# Altium schematic sheet cam_cross_link.SchDoc
size A3
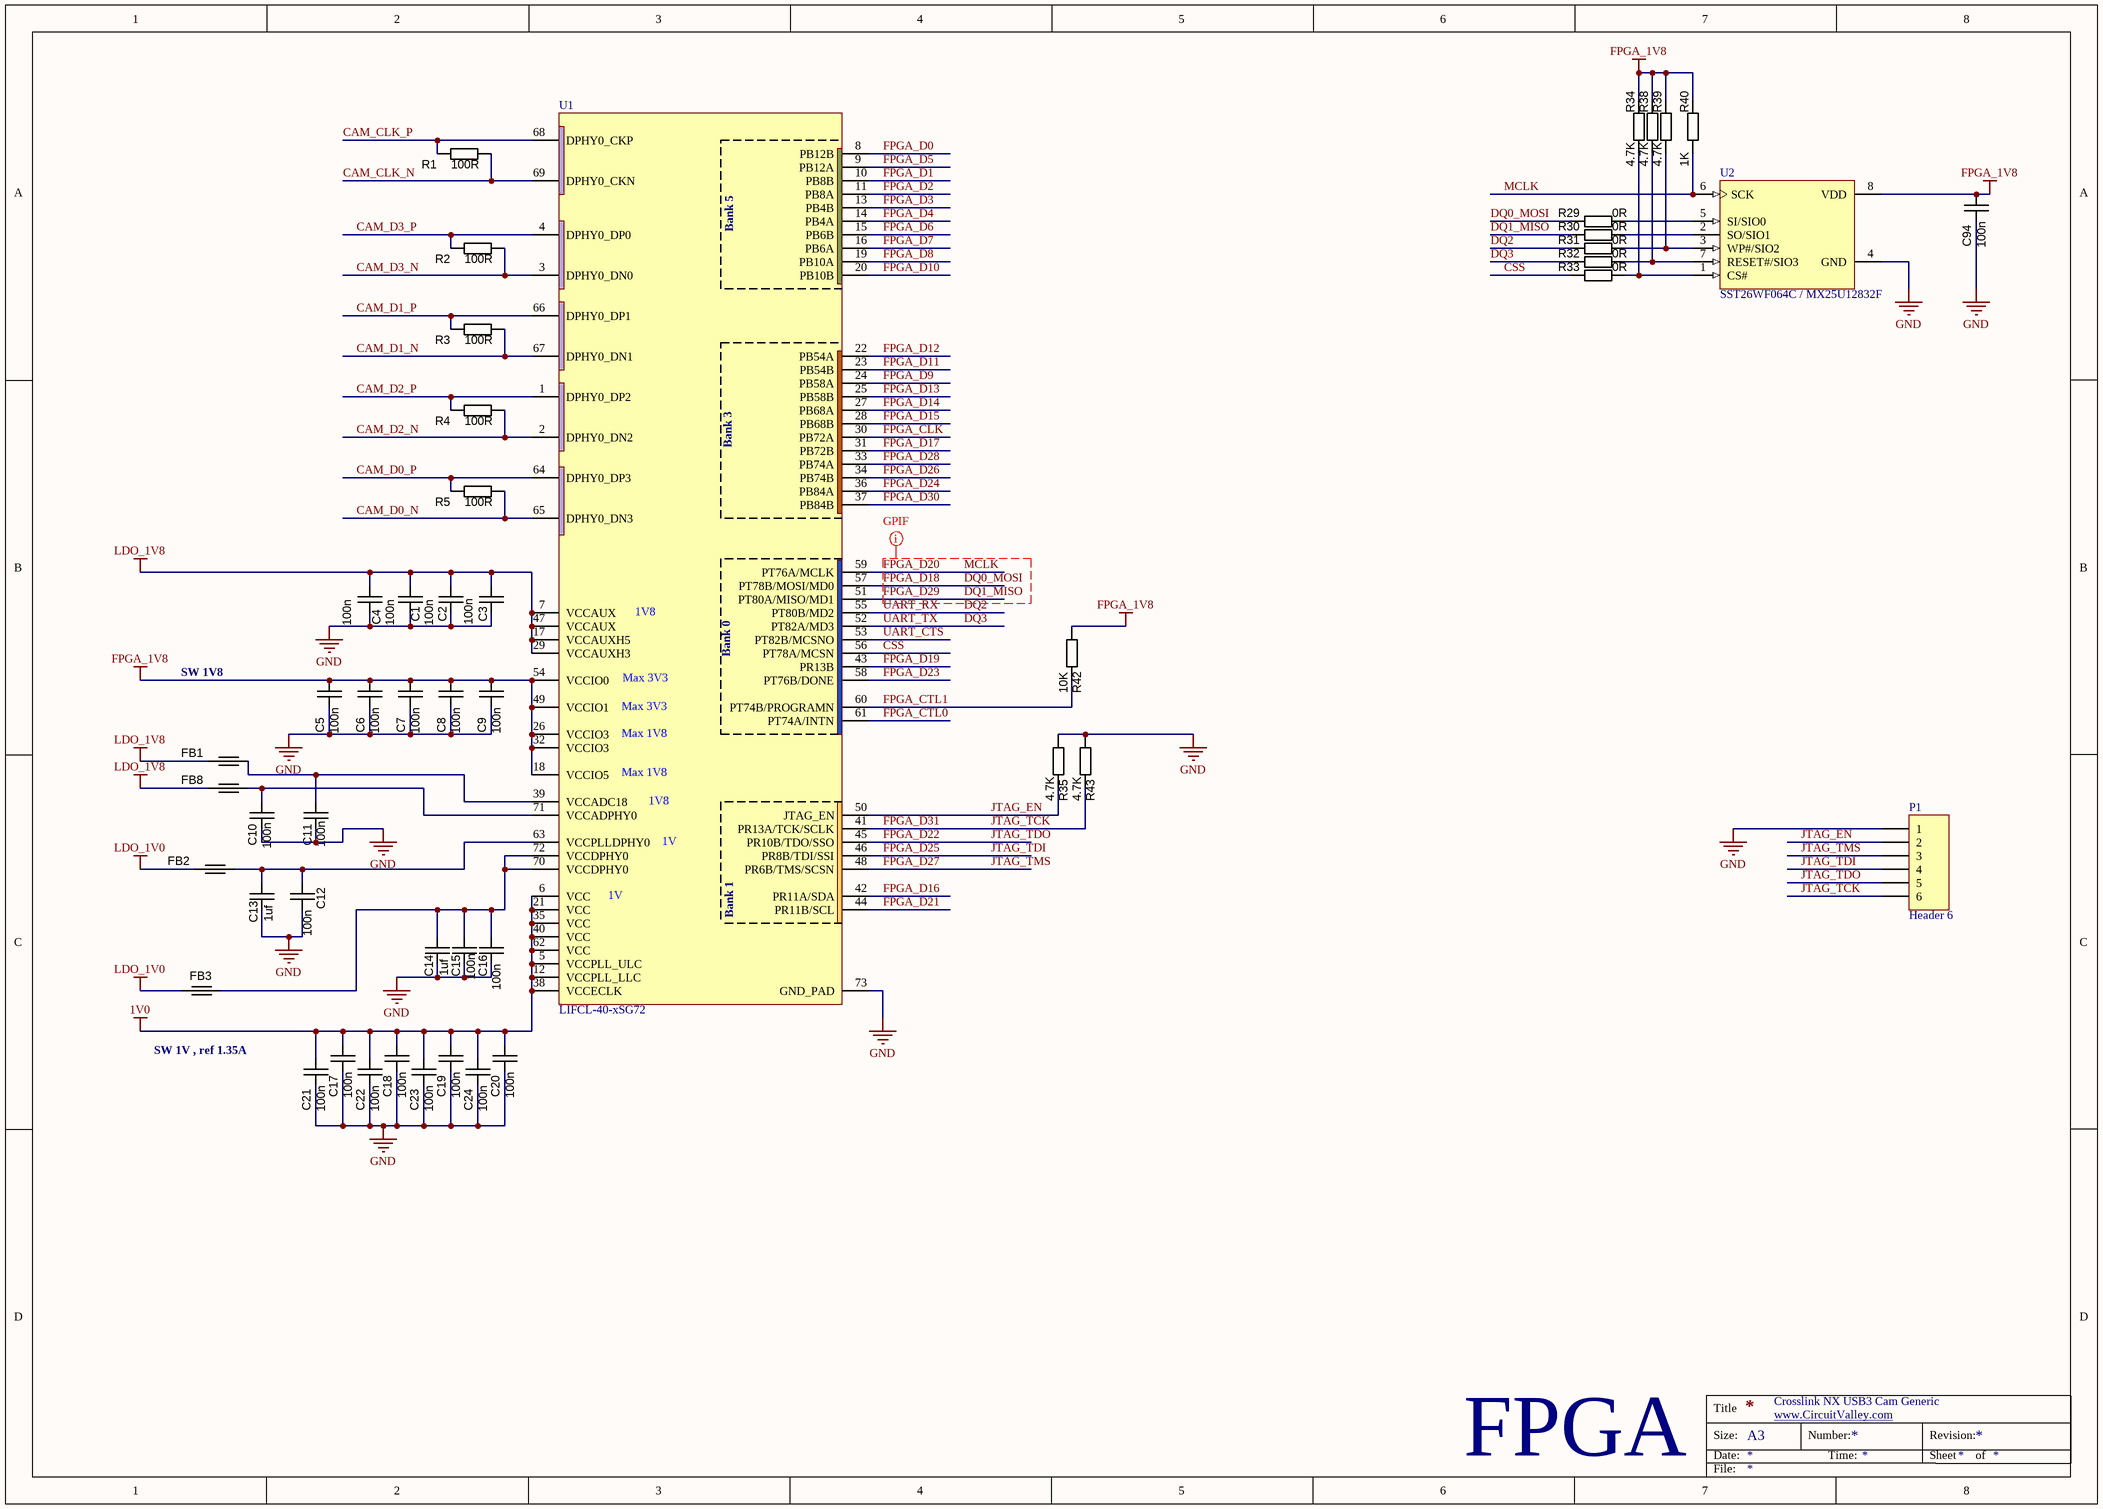
[diagram p0: cam_cross_link.SchDoc]

## Parts
C1  100n  [CAPC1608N]
C2  100n  [CAPC1608N]
C3  100n  [CAPC1608N]
C4  100n  [CAPC1608N]
C5  100n  [CAPC1608N]
C6  100n  [CAPC1608N]
C7  100n  [CAPC1608N]
C8  100n  [CAPC1608N]
C9  100n  [CAPC1608N]
C10  100n  [CAPC1608N]
C11  100n  [CAPC1608N]
C12  100n  [CAPC1608N]
C13  1uf  [CAPC1608N]
C14  1uf  [CAPC1608N]
C15  100n  [CAPC1608N]
C16  100n  [CAPC1608N]
C17  100n  [CAPC1608N]
C18  100n  [CAPC1608N]
C19  100n  [CAPC1608N]
C20  100n  [CAPC1608N]
C21  100n  [CAPC1608N]
C22  100n  [CAPC1608N]
C23  100n  [CAPC1608N]
C24  100n  [CAPC1608N]
C94  100n  [CAPC1608N]
FB1  (no value)  [FBC2012N]
FB2  (no value)  [FBC2012N]
FB3  (no value)  [FBC2012N]
FB8  (no value)  [FBC2012N]
P1  Header 6  [SMD_Solder_points_1.27]
R1  value 100R  [RESC1005N]  (hidden comment: Thick Film)
R2  value 100R  [RESC1005N]  (hidden comment: Thick Film)
R3  value 100R  [RESC1005N]  (hidden comment: Thick Film)
R4  value 100R  [RESC1005N]  (hidden comment: Thick Film)
R5  value 100R  [RESC1005N]  (hidden comment: Thick Film)
R29  value 0R  [RESC1608N_ZERO]  (hidden comment: Thick Film)
R30  value 0R  [RESC1608N_ZERO]  (hidden comment: Thick Film)
R31  value 0R  [RESC1608N_ZERO]  (hidden comment: Thick Film)
R32  value 0R  [RESC1608N_ZERO]  (hidden comment: Thick Film)
R33  value 0R  [RESC1608N_ZERO]  (hidden comment: Thick Film)
R34  value 4.7K  [RESC1608N_ZERO]  (hidden comment: Thick Film)
R35  value 4.7K  [RESC1608N_ZERO]  (hidden comment: Thick Film)
R38  value 4.7K  [RESC1608N_ZERO]  (hidden comment: Thick Film)
R39  value 4.7K  [RESC1608N_ZERO]  (hidden comment: Thick Film)
R40  value 1K  [RESC1608N_ZERO]  (hidden comment: Thick Film)
R42  value 10K  [RESC1608N_ZERO]  (hidden comment: Thick Film)
R43  value 4.7K  [RESC1608N_ZERO]  (hidden comment: Thick Film)
U1  LIFCL-40-xSG72  [QFN72_NX]
U2  SST26WF064C / MX25U12832F  [SOP8]

## Nets
1V0: C17.2 C18.2 C19.2 C20.2 C21.2 C22.2 C23.2 C24.2 U1.5(VCCPLL_ULC) U1.6(VCC) U1.12(VCCPLL_LLC) U1.21(VCC) U1.35(VCC) U1.38(VCCECLK) U1.40(VCC) U1.62(VCC)
FPGA_1V8: C5.2 C6.2 C7.2 C8.2 C9.2 C94.2 R34.1 R38.1 R39.1 R40.1 R42.1 U1.18(VCCIO5) U1.26(VCCIO3) U1.32(VCCIO3) U1.49(VCCIO1) U1.54(VCCIO0) U2.8(VDD)
GND: C1.1 C2.1 C3.1 C4.1 C5.1 C6.1 C7.1 C8.1 C9.1 C10.1 C11.1 C12.2 C13.1 C14.1 C15.1 C16.1 C17.1 C18.1 C19.1 C20.1 C21.1 C22.1 C23.1 C24.1 C94.1 P1.1 R35.1 R43.1 U1.73(GND_PAD) U2.4(GND)
LDO_1V0: FB2.1 FB3.1
LDO_1V8: C1.2 C2.2 C3.2 C4.2 FB1.1 FB8.1 U1.7(VCCAUX) U1.17(VCCAUXH5) U1.29(VCCAUXH3) U1.47(VCCAUX)
CAM_CLK_N: R1.1 U1.69(DPHY0_CKN)
CAM_CLK_P: R1.2 U1.68(DPHY0_CKP)
CAM_D0_N: R5.1 U1.65(DPHY0_DN3)
CAM_D0_P: R5.2 U1.64(DPHY0_DP3)
CAM_D1_N: R3.1 U1.67(DPHY0_DN1)
CAM_D1_P: R3.2 U1.66(DPHY0_DP1)
CAM_D2_N: R4.1 U1.2(DPHY0_DN2)
CAM_D2_P: R4.2 U1.1(DPHY0_DP2)
CAM_D3_N: R2.1 U1.3(DPHY0_DN0)
CAM_D3_P: R2.2 U1.4(DPHY0_DP0)
CSS: R33.2 U1.56(PT78A/MCSN)
DQ0_MOSI: R29.2 U1.57(PT78B/MOSI/MD0)  [also labelled FPGA_D18]
DQ1_MISO: R30.2 U1.51(PT80A/MISO/MD1)  [also labelled FPGA_D29]
DQ2: R31.2 U1.55(PT80B/MD2)  [also labelled UART_RX]
DQ3: R32.2 U1.52(PT82A/MD3)  [also labelled UART_TX]
FPGA_CLK: U1.30(PB72A)
FPGA_CTL0: U1.61(PT74A/INTN)
FPGA_CTL1: R42.2 U1.60(PT74B/PROGRAMN)
FPGA_D0: U1.8(PB12B)
FPGA_D1: U1.10(PB8B)
FPGA_D2: U1.11(PB8A)
FPGA_D3: U1.13(PB4B)
FPGA_D4: U1.14(PB4A)
FPGA_D5: U1.9(PB12A)
FPGA_D6: U1.15(PB6B)
FPGA_D7: U1.16(PB6A)
FPGA_D8: U1.19(PB10A)
FPGA_D9: U1.24(PB58A)
FPGA_D10: U1.20(PB10B)
FPGA_D11: U1.23(PB54B)
FPGA_D12: U1.22(PB54A)
FPGA_D13: U1.25(PB58B)
FPGA_D14: U1.27(PB68A)
FPGA_D15: U1.28(PB68B)
FPGA_D16: U1.42(PR11A/SDA)
FPGA_D17: U1.31(PB72B)
FPGA_D19: U1.43(PR13B)
FPGA_D20: R40.2 U1.59(PT76A/MCLK) U2.6(SCK)  [also labelled MCLK]
FPGA_D21: U1.44(PR11B/SCL)
FPGA_D22: P1.5 U1.45(PR10B/TDO/SSO)  [also labelled JTAG_TDO]
FPGA_D23: U1.58(PT76B/DONE)
FPGA_D24: U1.36(PB84A)
FPGA_D25: P1.4 U1.46(PR8B/TDI/SSI)  [also labelled JTAG_TDI]
FPGA_D26: U1.34(PB74B)
FPGA_D27: P1.3 U1.48(PR6B/TMS/SCSN)  [also labelled JTAG_TMS]
FPGA_D28: U1.33(PB74A)
FPGA_D30: U1.37(PB84B)
FPGA_D31: P1.6 R43.2 U1.41(PR13A/TCK/SCLK)  [also labelled JTAG_TCK]
JTAG_EN: P1.2 R35.2 U1.50(JTAG_EN)
UART_CTS: U1.53(PT82B/MCSNO)
NetC10_2: C10.2 FB8.2 U1.71(VCCADPHY0)
NetC11_2: C11.2 FB1.2 U1.39(VCCADC18)
NetC12_1: C12.1 C13.2 FB2.2 U1.63(VCCPLLDPHY0)
NetC14_2: C14.2 C15.2 C16.2 FB3.2 U1.70(VCCDPHY0) U1.72(VCCDPHY0)
NetR29_1: R29.1 U2.5(SI/SIO0)
NetR30_1: R30.1 U2.2(SO/SIO1)
NetR31_1: R31.1 R39.2 U2.3(WP#/SIO2)
NetR32_1: R32.1 R38.2 U2.7(RESET#/SIO3)
NetR33_1: R33.1 R34.2 U2.1(CS#)

## Layout directives
net class GPIF: DQ0_MOSI, DQ1_MISO, FPGA_D18, FPGA_D20, FPGA_D29, MCLK

## Notes on the sheet
- SW 1V8
- SW 1V , ref 1.35A
- Crosslink NX USB3 Cam Generic
- www.CircuitValley.com <http://www.CircuitValley.com>
- FPGA
- Title
- Size:
- Date:
- A3
- Number:
- Time:
- Revision:
- Sheet
- of
- File:
- (in symbol LIFCL-40-xSG72) Bank 5; Bank 3; 1V8; Bank 0; Max 3V3; Max 1V8; 1V; Bank 1

## Library data of the parts
C1-C24 C94 = CAPC_10p_0603_NP0_1%_50V: Capacitor SMD Cer 10pF 5% 50V NP0 0603; Manufacturer 1: Murata Electronics North America; Manufacturer Part Number 1: GRM1885C1H100FA01J; Part: C0603X104K5RAC; Ratings: 50V; NP0; Tolerance: ±5%; Operating Temperature: -55°C ~ 125°C; Package / Case: 0603 (1608 Metric); Size / Dimension: 0.063" L x 0.032" W (1.60mm x 0.81mm); Thickness (Max): 0.035" (0.90mm); Supplier 1: Digi-Key; Supplier Part Number 1: GRM1885C1H100FA01J-ND
  C1-C12 C15-C24 C94: Value: 100n
  C13 C14: Value: 1uf
FB1-FB3 FB8 = FERRITE_0805: Ferrite bead 2.2K Ohm at 100 MHz 200mA 0805 SMD; Manufacturer 1: Laird-Signal Integrity Products; Manufacturer Part Number 1: HZ0805B222R-10; Ratings: 200 mA; 800 mOhm DC; Impedance @ Frequency: 600 Ohm @ 100MHz; DC Resistance (DCR): 800 mOhm Max; Filter Type: Differential Mode - Single; Size / Dimension: 0.063" L x 0.031" W (1.60mm x 0.80mm); Current Rating: 200mA; Package / Case: 0805 (2012 Metric); Height (Max): 0.043" (1.09mm); ComponentLink1URL: http://www.lairdtech.com/WorkArea/linkit.aspx?LinkIdentifier=id&ItemID=4879; ComponentLink1Description: http://www.lairdtech.com/WorkArea/linkit.aspx?LinkIdentifier=id&ItemID=4879; Supplier 1: Digi-Key; Supplier Part Number 1: 240-2562-1-ND; Mounting Type: Surface Mount
P1 = Header 6: Header, 6-Pin; LatestRevisionDate: 17-Jul-2002; LatestRevisionNote: Re-released for DXP Platform.; Publisher: Altium Limited
R1-R5 = RES_1M_0402_5%: Resistor SMD chip 1M Ohm 0.063W 5% 0402; Manufacturer 1: Vishay Dale; Manufacturer Part Number 1: CRCW04021M00JNED; Ratings: 1/16 W; Power Rating: 0.063W, 1/16W; Package / Case: 0402 (1005 Metric); Tolerance: ±5%; Material: Thick Film; Manufacturer 2: Yageo; Manufacturer Part Number 2: RC0402JR-071ML; Supplier 1: Digi-Key; Supplier Part Number 1: 541-1.0MJCT-ND; ComponentLink1URL: http://www.vishay.com/doc?20035; ComponentLink1Description: http://www.vishay.com/doc?20035; Supplier 2: Digi-Key; Supplier Part Number 2: 311-1.0MJRCT-ND; ComponentLink2URL: http://www.yageo.com/documents/recent/PYu-RC0402_51_RoHS_L_6.pdf; ComponentLink2Description: http://www.yageo.com/documents/recent/PYu-RC0402_51_RoHS_L_6.pdf
R29-R35 R38-R40 R42 R43 = RES_0R_0603: Resistor SMD chip 0.0 Ohm 0.1W 0603; Manufacturer 1: Vishay/Dale; Manufacturer Part Number 1: CRCW06030000Z0EA; Tolerance: ±5%; Ratings: 1/10W; Package / Case: 0603 (1608metric); Supplier 1: Digi-Key; Supplier Part Number 1: 541-0.0GCT-ND
U1 = LIFCL-40-xSG72: QFN 72 LIFCL
U2 = MX25L12833F: Flash 128Mbit for Lattice FPGA